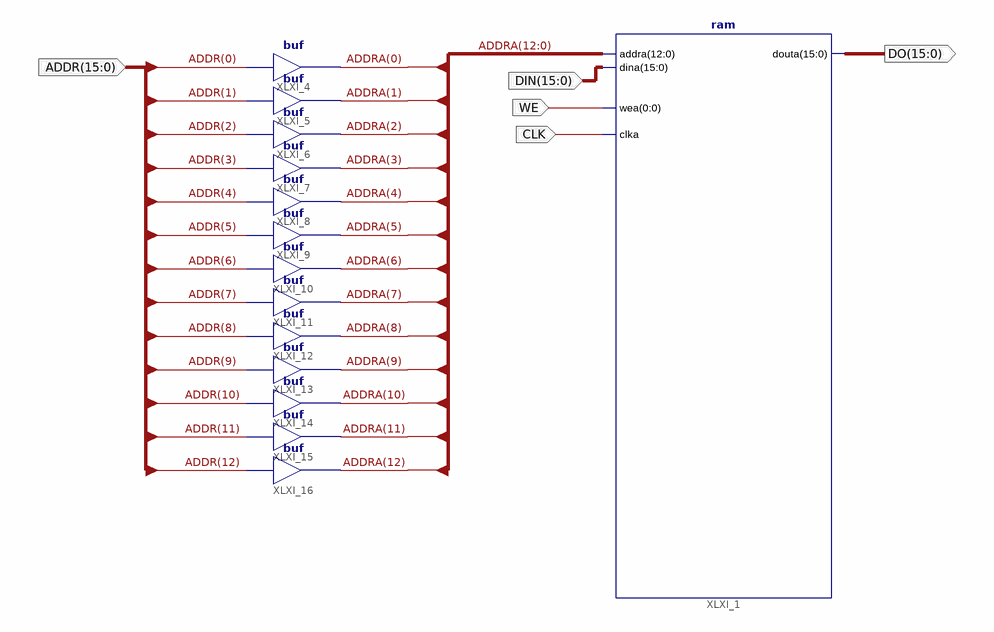
[diagram p0: schematic sheet 1]
// Xilinx ISE schematic ram_wrapper.sch (spartan6) as structural Verilog: 14 symbols, 5 ports
module ram_wrapper (
  input  [15:0] ADDR,
  input  [15:0] DIN,
  input  WE,
  input  CLK,
  output [15:0] DO
);

  wire [12:0] ADDRA;

  buf XLXI_4 (ADDRA[0], ADDR[0]);
  buf XLXI_5 (ADDRA[1], ADDR[1]);
  buf XLXI_6 (ADDRA[2], ADDR[2]);
  buf XLXI_7 (ADDRA[3], ADDR[3]);
  buf XLXI_8 (ADDRA[4], ADDR[4]);
  buf XLXI_9 (ADDRA[5], ADDR[5]);
  buf XLXI_10 (ADDRA[6], ADDR[6]);
  buf XLXI_11 (ADDRA[7], ADDR[7]);
  buf XLXI_12 (ADDRA[8], ADDR[8]);
  buf XLXI_13 (ADDRA[9], ADDR[9]);
  buf XLXI_14 (ADDRA[10], ADDR[10]);
  buf XLXI_15 (ADDRA[11], ADDR[11]);
  ram XLXI_1 (.addra(ADDRA), .dina(DIN), .wea(WE), .clka(CLK), .douta(DO));
  buf XLXI_16 (ADDRA[12], ADDR[12]);
endmodule
